# EAGLE design Oven Control (EAGLE 9.3.0)
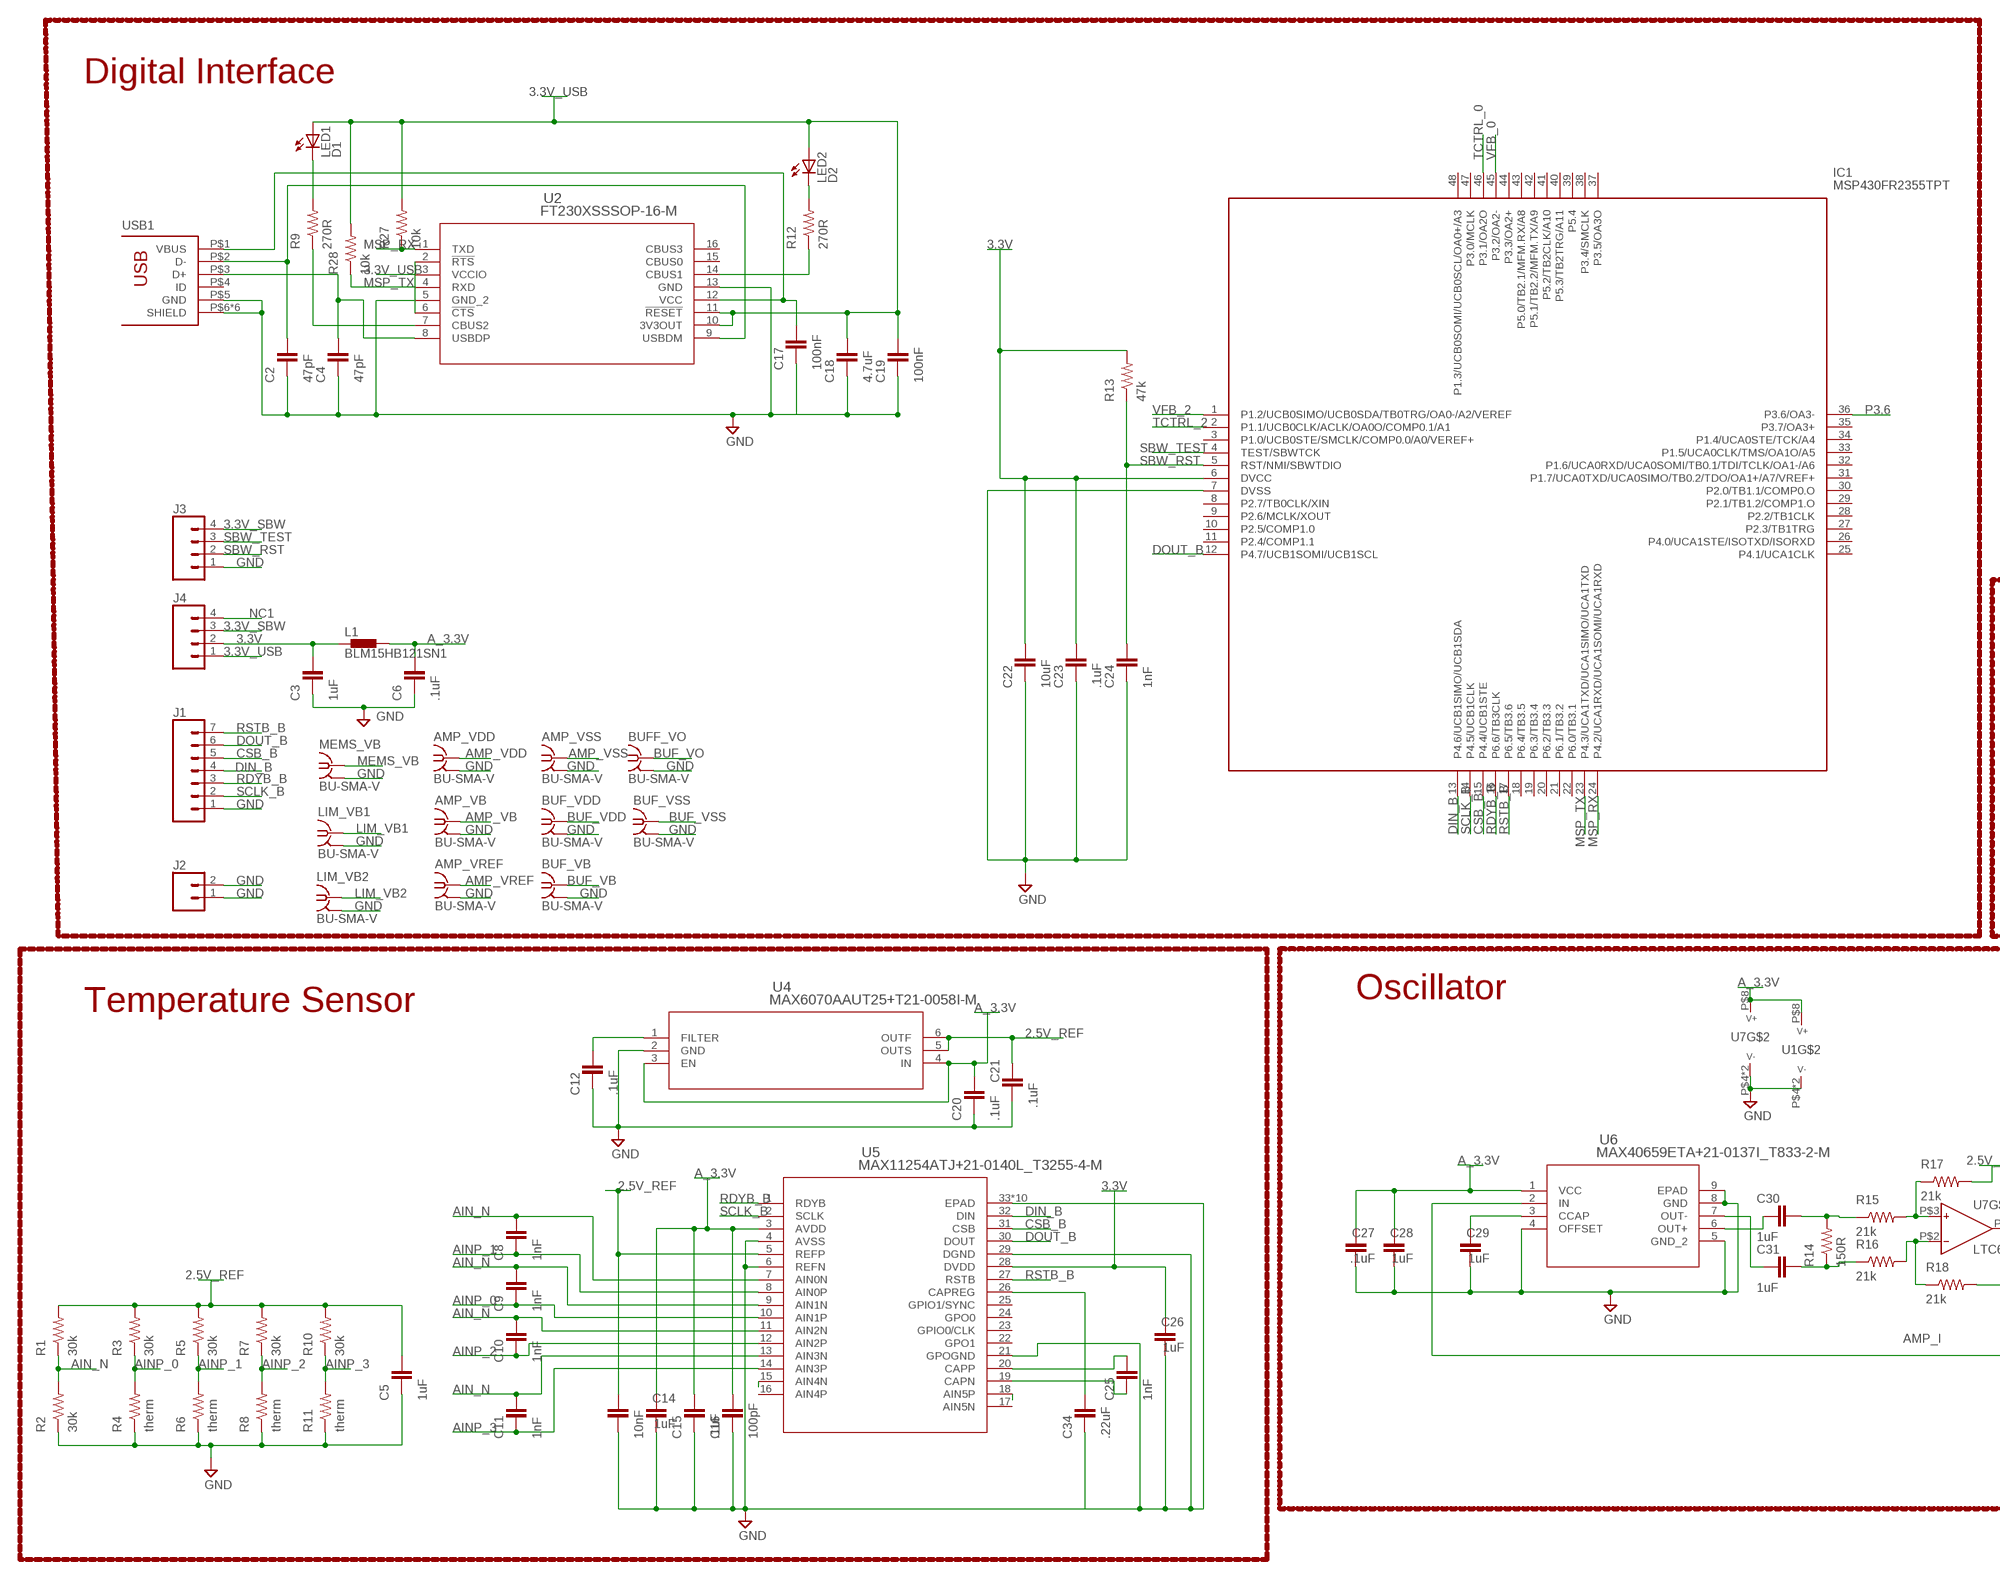
[diagram p0: schematic, sheet 1, part 1 of 2]
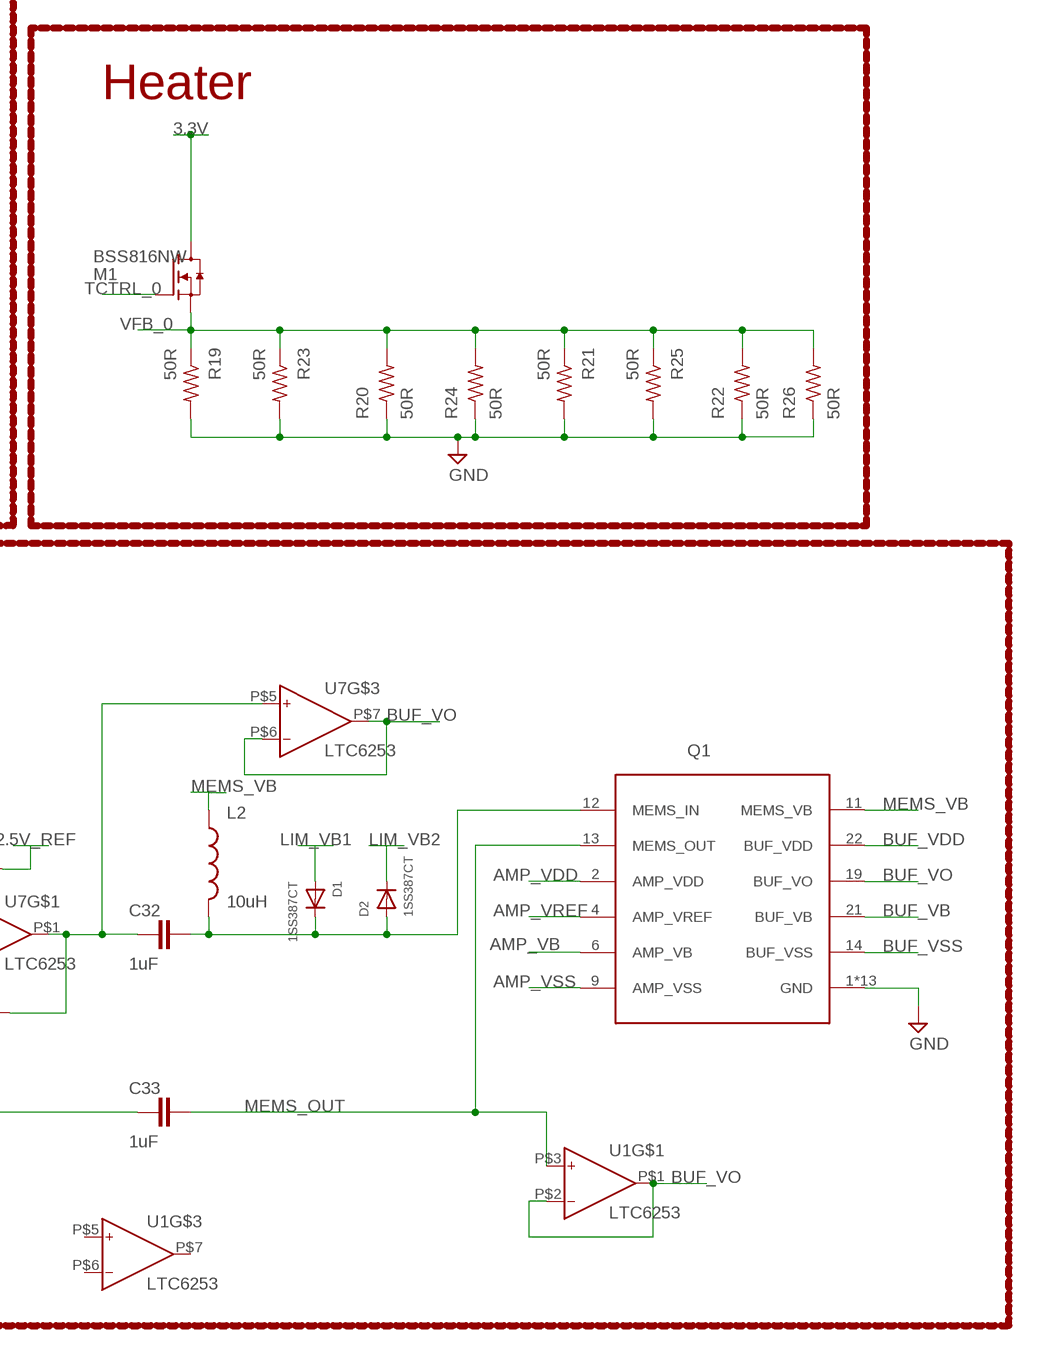
[diagram p1: schematic, sheet 1, part 2 of 2]

## Parts
AMP_VB  BU-SMA-V  [BU-SMA-V]
AMP_VDD  BU-SMA-V  [BU-SMA-V]
AMP_VREF  BU-SMA-V  [BU-SMA-V]
AMP_VSS  BU-SMA-V  [BU-SMA-V]
BUF_VB  BU-SMA-V  [BU-SMA-V]
BUF_VDD  BU-SMA-V  [BU-SMA-V]
BUF_VSS  BU-SMA-V  [BU-SMA-V]
BUFF_VO  BU-SMA-V  [BU-SMA-V]
C2  47pF  CAP0402-CAP  [0402-CAP]
C3  1uF  CAP0402-CAP  [0402-CAP]
C4  47pF  CAP0402-CAP  [0402-CAP]
C5  1uF  CAP0402-CAP  [0402-CAP]
C6  .1uF  CAP0402-CAP  [0402-CAP]
C8  1nF  CAP0402-CAP  [0402-CAP]
C9  1nF  CAP0402-CAP  [0402-CAP]
C10  1nF  CAP0402-CAP  [0402-CAP]
C11  1nF  CAP0402-CAP  [0402-CAP]
C12  .1uF  CAP0402-CAP  [0402-CAP]
C13  10nF  CAP0402-CAP  [0402-CAP]
C14  1uF  CAP0402-CAP  [0402-CAP]
C15  .1uF  CAP0402-CAP  [0402-CAP]
C16  100pF  CAP0402-CAP  [0402-CAP]
C17  100nF  CAP0402-CAP  [0402-CAP]
C18  4.7uF  CAP0402-CAP  [0402-CAP]
C19  100nF  CAP0402-CAP  [0402-CAP]
C20  .1uF  CAP0402-CAP  [0402-CAP]
C21  .1uF  CAP0402-CAP  [0402-CAP]
C22  10uF  CAP0603-CAP  [0603-CAP]
C23  .1uF  CAP0402-CAP  [0402-CAP]
C24  1nF  CAP0402-CAP  [0402-CAP]
C25  1nF  CAP0402-CAP  [0402-CAP]
C26  1uF  CAP0402-CAP  [0402-CAP]
C27  .1uF  CAP0402-CAP  [0402-CAP]
C28  1uF  CAP0402-CAP  [0402-CAP]
C29  1uF  CAP0402-CAP  [0402-CAP]
C30  1uF  CAP0402-CAP  [0402-CAP]
C31  1uF  CAP0402-CAP  [0402-CAP]
C32  1uF  CAP0402-CAP  [0402-CAP]
C33  1uF  CAP0402-CAP  [0402-CAP]
C34  .22uF  CAP0402-CAP  [0402-CAP]
D1  1SS387CT  [SOD-882]
D2  1SS387CT  [SOD-882]
IC1  MSP430FR2355TPT  [QFP50P900X900X145-48N]
J1  CONN_07  [1X07]
J2  CONN_02  [1X02]
J3  CONN_04  [1X04]
J4  CONN_04  [1X04]
L1  BLM15HB121SN1  [0402]
L2  10uH  INDUCTOR_0805  [R0805]
LED1  D1  LEDCHIPLED_0603  [CHIPLED_0603]
LED2  D2  LEDCHIPLED_0603  [CHIPLED_0603]
LIM_VB1  BU-SMA-V  [BU-SMA-V]
LIM_VB2  BU-SMA-V  [BU-SMA-V]
M1  BSS816NW  [SOT-323]
MEMS_VB  BU-SMA-V  [BU-SMA-V]
Q1  MEMS_RESONATOR  [DIL24]
R1  30k  R-US_R0603  [R0603]
R2  30k  R-US_R0603  [R0603]
R3  30k  R-US_R0603  [R0603]
R4  therm  R-US_R0603  [R0603]
R5  30k  R-US_R0603  [R0603]
R6  therm  R-US_R0603  [R0603]
R7  30k  R-US_R0603  [R0603]
R8  therm  R-US_R0603  [R0603]
R9  270R  R-US_R0603  [R0603]
R10  30k  R-US_R0603  [R0603]
R11  therm  R-US_R0603  [R0603]
R12  270R  R-US_R0603  [R0603]
R13  47k  R-US_R0603  [R0603]
R14  150R  R-US_R0402  [R0402]
R15  21k  R-US_R0402  [R0402]
R16  21k  R-US_R0402  [R0402]
R17  21k  R-US_R0402  [R0402]
R18  21k  R-US_R0402  [R0402]
R19  50R  R-US_R1206  [R1206]
R20  50R  R-US_R1206  [R1206]
R21  50R  R-US_R1206  [R1206]
R22  50R  R-US_R1206  [R1206]
R23  50R  R-US_R1206  [R1206]
R24  50R  R-US_R1206  [R1206]
R25  50R  R-US_R1206  [R1206]
R26  50R  R-US_R1206  [R1206]
R27  10k  R-US_R0402  [R0402]
R28  10k  R-US_R0402  [R0402]
U1  LTC6253  [DFN]
U2  FT230XSSSOP-16-M  [SSOP-16-M]
U4  MAX6070AAUT25+T21-0058I-M  [21-0058I-M]
U5  MAX11254ATJ+21-0140L_T3255-4-M  [21-0140L_T3255-4-M]
U6  MAX40659ETA+21-0137I_T833-2-M  [21-0137I_T833-2-M]
U7  LTC6253  [DFN]
USB1  USB-OTGMICRO-AB  [USB-MICRO-AB]

## Nets
2.5V_REF: C5.2 C13.2 C21.2 R1.2 R3.2 R5.2 R7.2 R10.2 R17.2 U4.5(OUTS) U4.6(OUTF) U5.5(REFP)
3.3V: C3.2 C22.2 C23.2 C26.2 IC1.6(DVCC) J4.2 L1.1 M1.D R13.2 U5.28(DVDD)
3.3V_SBW: J3.4 J4.3
3.3V_USB: C18.2 C19.2 J4.1 LED1.A LED2.A R27.2 R28.2 U2.3(VCCIO) U2.10(3V3OUT) U2.11(!RESET)
5V_USB: C17.2 U2.12(VCC) USB1.P$1(VBUS)
A_3.3V: C6.2 C14.2 C15.2 C16.2 C20.2 C27.2 C28.2 L1.2 U1.P$8(V+) U4.3(EN) U4.4(IN) U5.3(AVDD) U6.1(VCC) U7.P$8(V+)
AIN_N: C8.2 C9.2 C10.2 C11.2 R1.1 R2.2 U5.7(AIN0N) U5.9(AIN1N) U5.11(AIN2N) U5.13(AIN3N)
AINP_0: C9.1 R3.1 R4.2 U5.10(AIN1P)
AINP_1: C8.1 R5.1 R6.2 U5.8(AIN0P)
AINP_2: C10.1 R7.1 R8.2 U5.12(AIN2P)
AINP_3: C11.1 R10.1 R11.2 U5.14(AIN3P)
AMP_I: C33.1 U6.2(IN)
AMP_VB: AMP_VB.1 Q1.6(AMP_VB)
AMP_VDD: AMP_VDD.1 Q1.2(AMP_VDD)
AMP_VREF: AMP_VREF.1 Q1.4(AMP_VREF)
AMP_VSS: AMP_VSS.1 Q1.9(AMP_VSS)
BUF_VB: BUF_VB.1 Q1.21(BUF_VB)
BUF_VDD: BUF_VDD.1 Q1.22(BUF_VDD)
BUF_VO: BUFF_VO.1 Q1.19(BUF_VO) U1.P$1(OUT) U1.P$2(IN-) U7.P$6(IN-) U7.P$7(OUT)
BUF_VSS: BUF_VSS.1 Q1.14(BUF_VSS)
CSB_B: IC1.15(P4.4/UCB1STE) J1.5 U5.31(CSB)
D+: C4.2 U2.8(USBDP) USB1.P$3(D+)
D-: C2.2 U2.9(USBDM) USB1.P$2(D-)
DIN_B: IC1.13(P4.6/UCB1SIMO/UCB1SDA) J1.4 U5.32(DIN)
DOUT_B: IC1.12(P4.7/UCB1SOMI/UCB1SCL) J1.6 U5.30(DOUT)
GND: AMP_VB.2 AMP_VB.3 AMP_VB.4 AMP_VB.5 AMP_VDD.2 AMP_VDD.3 AMP_VDD.4 AMP_VDD.5 AMP_VREF.2 AMP_VREF.3 AMP_VREF.4 AMP_VREF.5 AMP_VSS.2 AMP_VSS.3 AMP_VSS.4 AMP_VSS.5 BUF_VB.2 BUF_VB.3 BUF_VB.4 BUF_VB.5 BUF_VDD.2 BUF_VDD.3 BUF_VDD.4 BUF_VDD.5 BUF_VSS.2 BUF_VSS.3 BUF_VSS.4 BUF_VSS.5 BUFF_VO.2 BUFF_VO.3 BUFF_VO.4 BUFF_VO.5 C2.1 C3.1 C4.1 C5.1 C6.1 C12.1 C13.1 C14.1 C15.1 C16.1 C17.1 C18.1 C19.1 C20.1 C21.1 C22.1 C23.1 C24.1 C26.1 C27.1 C28.1 C29.1 C34.1 IC1.7(DVSS) J1.1 J2.1 J2.2 J3.1 LIM_VB1.2 LIM_VB1.3 LIM_VB1.4 LIM_VB1.5 LIM_VB2.2 LIM_VB2.3 LIM_VB2.4 LIM_VB2.5 MEMS_VB.2 MEMS_VB.3 MEMS_VB.4 MEMS_VB.5 Q1.1(GND) Q1.3(GND) Q1.5(GND) Q1.7(GND) Q1.8(GND) Q1.10(GND) Q1.15(GND) Q1.16(GND) Q1.17(GND) Q1.18(GND) Q1.20(GND) Q1.23(GND) Q1.24(GND) R2.1 R4.1 R6.1 R8.1 R11.1 R19.2 R20.1 R21.2 R22.1 R23.2 R24.1 R25.2 R26.1 U1.P$4(V-) U1.P$9(V-) U2.5(GND_2) U2.13(GND) U4.2(GND) U5.4(AVSS) U5.6(REFN) U5.21(GPOGND) U5.29(DGND) U5.33(EPAD) U5.P$1(EPAD) U5.P$2(EPAD) U5.P$3(EPAD) U5.P$4(EPAD) U5.P$5(EPAD) U5.P$6(EPAD) U5.P$7(EPAD) U5.P$8(EPAD) U5.P$9(EPAD) U6.4(OFFSET) U6.5(GND_2) U6.8(GND) U6.9(EPAD) U7.P$4(V-) U7.P$9(V-) USB1.P$5(GND) USB1.P$6(SHIELD) USB1.P$7(SHIELD) USB1.P$8(SHIELD) USB1.P$9(SHIELD) USB1.P$10(SHIELD) USB1.P$11(SHIELD)
LIM_VB1: D1.A LIM_VB1.1
LIM_VB2: D2.C LIM_VB2.1
MEMS_IN: C32.2 D1.C D2.A L2.2 Q1.12(MEMS_IN)
MEMS_OUT: C33.2 Q1.13(MEMS_OUT) U1.P$3(IN+)
MEMS_VB: L2.1 MEMS_VB.1 Q1.11(MEMS_VB)
MSP_RX: IC1.24(P4.2/UCA1RXD/UCA1SOMI/UCA1RXD) R27.1 U2.1(TXD)
MSP_TX: IC1.23(P4.3/UCA1TXD/UCA1SIMO/UCA1TXD) R28.1 U2.4(RXD)
N$1: C25.2 U5.20(CAPP)
N$2: C25.1 U5.19(CAPN)
N$3: C31.2 R14.1 R16.1
N$4: C29.2 U6.3(CCAP)
N$5: U5.17(AIN5N)
N$6: C12.2 U4.1(FILTER)
N$7: C30.2 R14.2 R15.1
N$8: U5.16(AIN4P)
N$10: C34.2 U5.26(CAPREG)
N$12: R15.2 R17.1 U7.P$3(IN+)
N$13: R16.2 R18.1 U7.P$2(IN-)
N$15: U2.2(!RTS) U2.6(!CTS)
N$18: C32.1 R18.2 U7.P$1(OUT) U7.P$5(IN+)
N$19: C30.1 U6.6(OUT+)
N$20: LED2.C R12.2
N$21: LED1.C R9.2
N$26: C31.1 U6.7(OUT-)
N$34: U5.18(AIN5P)
N$35: U5.15(AIN4N)
NC1: J4.4
P3.6: IC1.36(P3.6/OA3-)
RDYB_B: IC1.16(P6.6/TB3CLK) J1.3 U5.1(RDYB)
RSTB_B: IC1.17(P6.5/TB3.6) J1.7 U5.27(RSTB)
RX#1: R12.1 U2.14(CBUS1)
SBW_RST: C24.2 IC1.5(RST/NMI/SBWTDIO) J3.2 R13.1
SBW_TEST: IC1.4(TEST/SBWTCK) J3.3
SCLK_B: IC1.14(P4.5/UCB1CLK) J1.2 U5.2(SCLK)
TCTRL_0: IC1.46(P3.1/OA2O) M1.G
TCTRL_2: IC1.2(P1.1/UCB0CLK/ACLK/OA0O/COMP0.1/A1)
TX#1: R9.1 U2.7(CBUS2)
VFB_0: IC1.45(P3.2/OA2-) M1.S R19.1 R20.2 R21.1 R22.2 R23.1 R24.2 R25.1 R26.2
VFB_2: IC1.1(P1.2/UCB0SIMO/UCB0SDA/TB0TRG/OA0-/A2/VEREF)
Unconnected: IC1.3(P1.0/UCB0STE/SMCLK/COMP0.0/A0/VEREF+) IC1.8(P2.7/TB0CLK/XIN) IC1.9(P2.6/MCLK/XOUT) IC1.10(P2.5/COMP1.0) IC1.11(P2.4/COMP1.1) IC1.18(P6.4/TB3.5) IC1.19(P6.3/TB3.4) IC1.20(P6.2/TB3.3) IC1.21(P6.1/TB3.2) IC1.22(P6.0/TB3.1) IC1.25(P4.1/UCA1CLK) IC1.26(P4.0/UCA1STE/ISOTXD/ISORXD) IC1.27(P2.3/TB1TRG) IC1.28(P2.2/TB1CLK) IC1.29(P2.1/TB1.2/COMP1.O) IC1.30(P2.0/TB1.1/COMP0.O) IC1.31(P1.7/UCA0TXD/UCA0SIMO/TB0.2/TDO/OA1+/A7/VREF+) IC1.32(P1.6/UCA0RXD/UCA0SOMI/TB0.1/TDI/TCLK/OA1-/A6) IC1.33(P1.5/UCA0CLK/TMS/OA1O/A5) IC1.34(P1.4/UCA0STE/TCK/A4) IC1.35(P3.7/OA3+) IC1.37(P3.5/OA3O) IC1.38(P3.4/SMCLK) IC1.39(P5.4) IC1.40(P5.3/TB2TRG/A11) IC1.41(P5.2/TB2CLK/A10) IC1.42(P5.1/TB2.2/MFM.TX/A9) IC1.43(P5.0/TB2.1/MFM.RX/A8) IC1.44(P3.3/OA2+) IC1.47(P3.0/MCLK) IC1.48(P1.3/UCB0SOMI/UCB0SCL/OA0+/A3) U1.P$5(IN+) U1.P$6(IN-) U1.P$7(OUT) U2.15(CBUS0) U2.16(CBUS3) U5.22(GPO1) U5.23(GPIO0/CLK) U5.24(GPO0) U5.25(GPIO1/SYNC) USB1.P$4(ID)

## Notes on the sheet
- Digital Interface
- Heater
- Oscillator
- Temperature Sensor

## Library data of the parts
AMP_VB AMP_VDD AMP_VREF AMP_VSS BUF_VB BUF_VDD BUF_VSS BUFF_VO LIM_VB1 LIM_VB2 MEMS_VB = con-coax:BU-SMA-V: FEMALE SMA CONNECTOR Radiall distributor RS 112-3794; OC_FARNELL: unknown; OC_NEWARK: unknown
C2-C6 C8-C34 = pie:CAP: Capacitor Standard 0603 ceramic capacitor, and 0.1" leaded capacitor.; PIE-INT-REF-NUM: CAPACITOR-GENERIC
D1 D2 = Oven Control Lib:1SS387CT; PART_NO: 1SS387CT
IC1 = Oven Control Lib:MSP430FR2355TPT: 16-bit Microcontrollers - MCU 24MHz 105C ULP Microcontroller With 32 KB FRAM, 4 KB SRAM, 44 IO, 12-bit ADC, 12-bit DACs, OpAmp/PGA 48-LQFP -40 to 105 Source: Datasheet <https://www.arrow.com/en/products/msp430fr2355tpt/texas-instruments>; DESCRIPTION: 16-bit Microcontrollers - MCU 24MHz 105C ULP Microcontroller With 32 KB FRAM, 4 KB SRAM, 44 IO, 12-bit ADC, 12-bit DACs, OpAmp/PGA 48-LQFP -40 to 105; HEIGHT: 1.45mm; MANUFACTURER_NAME: Texas Instruments; MANUFACTURER_PART_NUMBER: MSP430FR2355TPT
J1 = SparkFun-Connectors:CONN_07: Multi connection point. Often used as Generic Header-pin footprint for 0.1 inch spaced/style header connections On any of the 0.1 inch spaced packages, you can populate with these: Break Away Headers - Straight <https://www.sparkfun.com/products/116> (PRT-00116) Break Away Male Headers - Right Angle <https://www.sparkfun.com/products/553> (PRT-00553) Female Headers <https://www.sparkfun.com/products/115> (PRT-00115) Break Away Headers - Machine Pin <https://www.sparkfun.com/products/117> (PRT-00117) Break Away Female Headers - Swiss Machine Pin <https://www.sparkfun.com/products/743> (PRT-00743) For SCREWTERMINALS and SPRING TERMINALS visit here: Screw Terimnals on SparkFun.com <https://www.sparkfun.com/search/results?term=Screw+Terminals> (5mm/3.5mm/2.54mm spacing) This device is also useful as a general connection point to wire up your design to another part of your project. Our various solder wires solder well into these plated through hole pads. Hook-Up Wire - Assortment (Stranded, 22 AWG) <https://www.sparkfun.com/products/11375> (PRT-11375) Hook-Up Wire - Assortment (Solid Core, 22 AWG) <https://www.sparkfun.com/products/11367> (PRT-11367) View the entire wire category on our website here <https://www.sparkfun.com/categories/141> Special notes: Molex polarized connector foot print use with SKU : PRT-08231 with associated crimp pins and housings. 1MM SMD Version SKU: PRT-10208 NOTES ON THE VARIANTS LOCK and LOCK_LONGPADS... This footprint was designed to help hold the alignment of a through-hole component (i.e. 6-pin header) while soldering it into place. You may notice that each hole has been shifted either up or down by 0.005 of an inch from it's more standard position (which is a perfectly straight line). This slight alteration caused the pins (the squares in the middle) to touch the edges of the holes. Because they are alternating, it causes a "brace" to hold the component in place. 0.005 has proven to be the perfect amount of "off-center" position when using our standard breakaway headers. Although looks a little odd when you look at the bare footprint, once you have a header in there, the alteration is very hard to notice. Also,if you push a header all the way into place, it is covered up entirely on the bottom side.
J2 = SparkFun-Connectors:CONN_02: Multi connection point. Often used as Generic Header-pin footprint for 0.1 inch spaced/style header connections On any of the 0.1 inch spaced packages, you can populate with these: Break Away Headers - Straight <https://www.sparkfun.com/products/116> (PRT-00116) Break Away Male Headers - Right Angle <https://www.sparkfun.com/products/553> (PRT-00553) Female Headers <https://www.sparkfun.com/products/115> (PRT-00115) Break Away Headers - Machine Pin <https://www.sparkfun.com/products/117> (PRT-00117) Break Away Female Headers - Swiss Machine Pin <https://www.sparkfun.com/products/743> (PRT-00743) For SCREWTERMINALS and SPRING TERMINALS visit here: Screw Terimnals on SparkFun.com <https://www.sparkfun.com/search/results?term=Screw+Terminals> (5mm/3.5mm/2.54mm spacing) This device is also useful as a general connection point to wire up your design to another part of your project. Our various solder wires solder well into these plated through hole pads. Hook-Up Wire - Assortment (Stranded, 22 AWG) <https://www.sparkfun.com/products/11375> (PRT-11375) Hook-Up Wire - Assortment (Solid Core, 22 AWG) <https://www.sparkfun.com/products/11367> (PRT-11367) View the entire wire category on our website here <https://www.sparkfun.com/categories/141> Special notes: Molex polarized connector foot print use with: PRT-08233 with associated crimp pins and housings. 2.54_SCREWTERM for use with PRT-10571. 3.5mm Screw Terminal footprints for PRT-08084 5mm Screw Terminal footprints for use with PRT-08432
J3 J4 = SparkFun-Connectors:CONN_04: Multi connection point. Often used as Generic Header-pin footprint for 0.1 inch spaced/style header connections On any of the 0.1 inch spaced packages, you can populate with these: Break Away Headers - Straight <https://www.sparkfun.com/products/116> (PRT-00116) Break Away Male Headers - Right Angle <https://www.sparkfun.com/products/553> (PRT-00553) Female Headers <https://www.sparkfun.com/products/115> (PRT-00115) Break Away Headers - Machine Pin <https://www.sparkfun.com/products/117> (PRT-00117) Break Away Female Headers - Swiss Machine Pin <https://www.sparkfun.com/products/743> (PRT-00743) For SCREWTERMINALS and SPRING TERMINALS visit here: Screw Terimnals on SparkFun.com <https://www.sparkfun.com/search/results?term=Screw+Terminals> (5mm/3.5mm/2.54mm spacing) This device is also useful as a general connection point to wire up your design to another part of your project. Our various solder wires solder well into these plated through hole pads. Hook-Up Wire - Assortment (Stranded, 22 AWG) <https://www.sparkfun.com/products/11375> (PRT-11375) Hook-Up Wire - Assortment (Solid Core, 22 AWG) <https://www.sparkfun.com/products/11367> (PRT-11367) View the entire wire category on our website here <https://www.sparkfun.com/categories/141> Special notes: Molex polarized connector foot print use with SKU : PRT-08231 with associated crimp pins and housings. 1MM SMD Version SKU: PRT-10208; PROD_ID: CONN-09696
L1 = inductors:BLM15H: EMIFIL (R) Chip Ferrite Bead for GHz Noise Source: http://www.murata.com/ Ferrite Bead BLM15H.pdf
L2 = Oven Control Lib:INDUCTOR_0805
LED1 LED2 = adafruit:LED: LED OSRAM: - CHIPLED LG R971, LG N971, LY N971, LG Q971, LY Q971, LO R971, LY R971 LH N974, LH R974 LS Q976, LO Q976, LY Q976 LO Q996 - Hyper CHIPLED LW Q18S LB Q993, LB Q99A, LB R99A - SideLED LS A670, LO A670, LY A670, LG A670, LP A670 LB A673, LV A673, LT A673, LW A673 LH A674 LY A675 LS A676, LA A676, LO A676, LY A676, LW A676 LS A679, LY A679, LG A679 - Hyper Micro SIDELED® LS Y876, LA Y876, LO Y876, LY Y876 LT Y87S - SmartLED LW L88C, LW L88S LB L89C, LB L89S, LG L890 LS L89K, LO L89K, LY L89K LS L896, LA L896, LO L896, LY L896 - TOPLED LS T670, LO T670, LY T670, LG T670, LP T670 LSG T670, LSP T670, LSY T670, LOP T670, LYG T670 LG T671, LOG T671, LSG T671 LB T673, LV T673, LT T673, LW T673 LH T674 LS T676, LA T676, LO T676, LY T676, LB T676, LH T676, LSB T676, LW T676 LB T67C, LV T67C, LT T67C, LS T67K, LO T67K, LY T67K, LW E67C LS E67B, LA E67B, LO E67B, LY E67B, LB E67C, LV E67C, LT E67C LW T67C LS T679, LY T679, LG T679 LS T770, LO T770, LY T770, LG T770, LP T770 LB T773, LV T773, LT T773, LW T773 LH T774 LS E675, LA E675, LY E675, LS T675 LS T776, LA T776, LO T776, LY T776, LB T776 LHGB T686 LT T68C, LB T68C - Hyper Mini TOPLED® LB M676 - Mini TOPLED Santana® LG M470 LS M47K, LO M47K, LY M47K Source: http://www.osram.convergy.de/
M1 = Oven Control Lib:BSS816NW
Q1 = Oven Control Lib:MEMS_RESONATOR
R1-R13 = pie:R-US_: RESISTOR, American symbol; DESCRIPTION: RESISTOR, American symbol; DISTRIBUTOR: DigiKey; MANUFACTURER: Rohm Semiconductor; NOTES: Cut Tape; PACKAGE: R0603; VALUE: >VALUE
R14-R28 = pie:R-US_: RESISTOR, American symbol; PIE-INT-REF-NUM: RESISTOR-GENERIC
U1 = Oven Control Lib:LTC6253
U2 = Oven Control Lib:FT230XS; MANUFACTURER_PART_NUMBER: FT230XS; VENDOR: FTDI Future Technology Devices International Ltd
U4 = Oven Control Lib:MAX6070AAUT25+T; MANUFACTURER_PART_NUMBER: MAX6070AAUT25+T; VENDOR: Maxim Integrated Products
U5 = Oven Control Lib:MAX11254ATJ+; MANUFACTURER_PART_NUMBER: MAX11254ATJ+; VENDOR: Maxim Integrated Products
U6 = Oven Control Lib:MAX40659ETA+; MANUFACTURER_PART_NUMBER: MAX40659ETA+; VENDOR: Maxim Integrated Products
U7 = Oven Control Lib:LTC6253; PART_NO: LTC6253
USB1 = pie:USB-OTG: USB Connector OTG connector with ID pin; PIE-DIGIKEY-PN-PRI: H11635CT-ND; PIE-INT-REF-NUM: USB

## Board
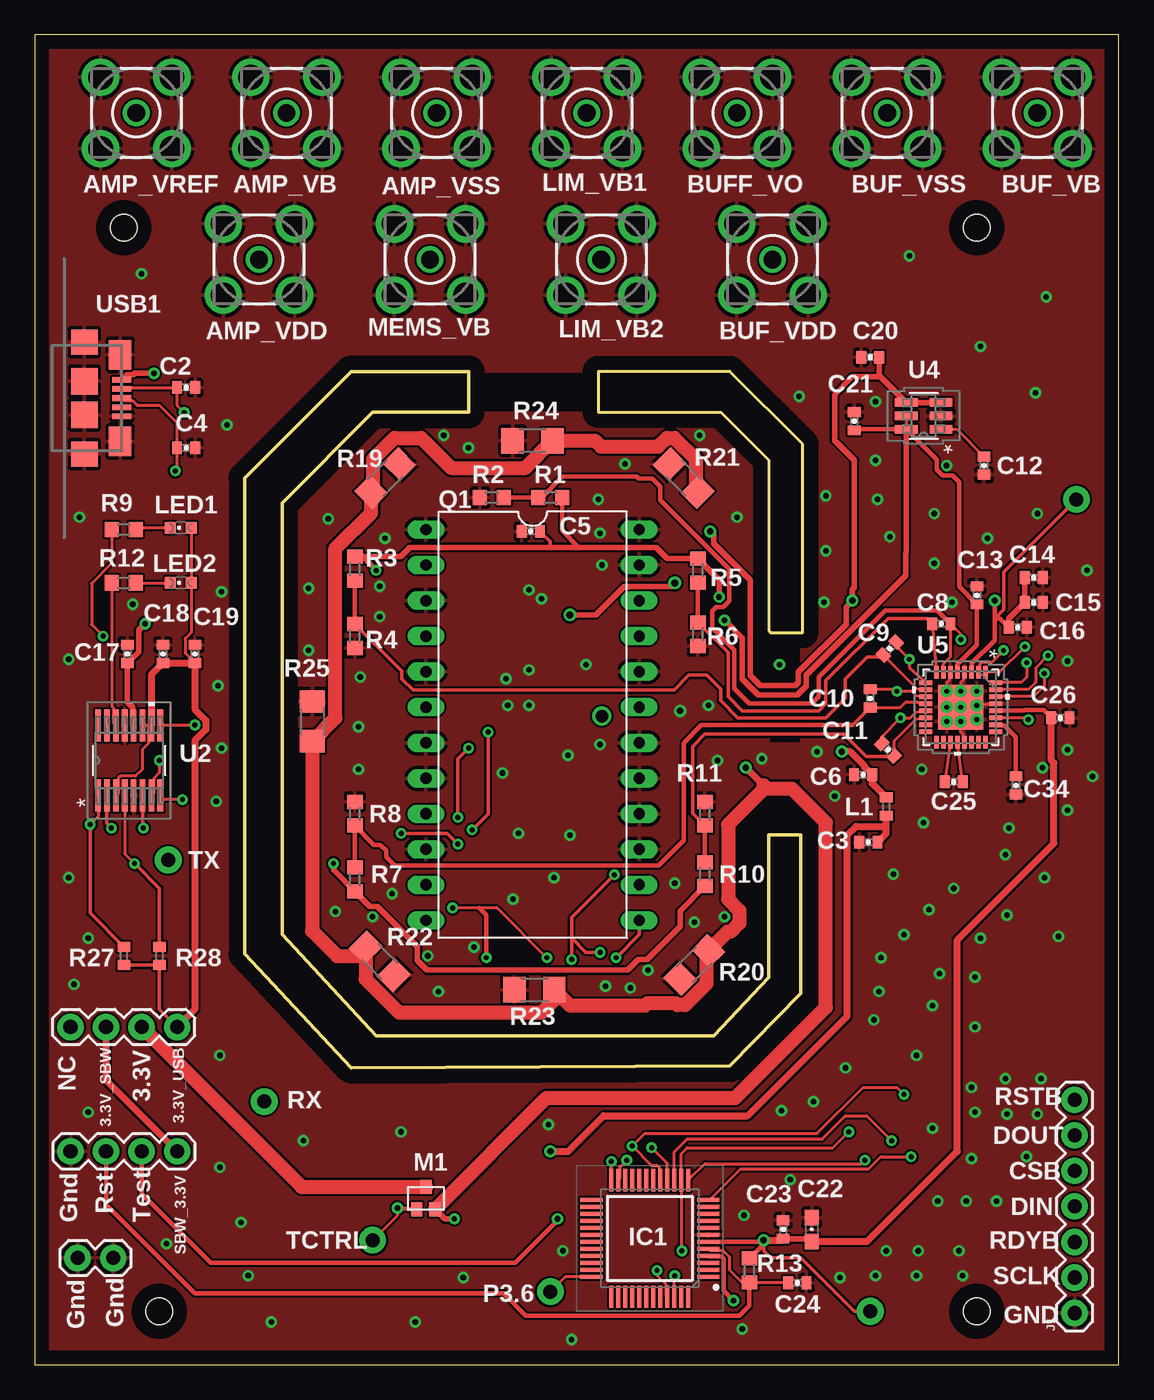
[diagram p2: board, top side]
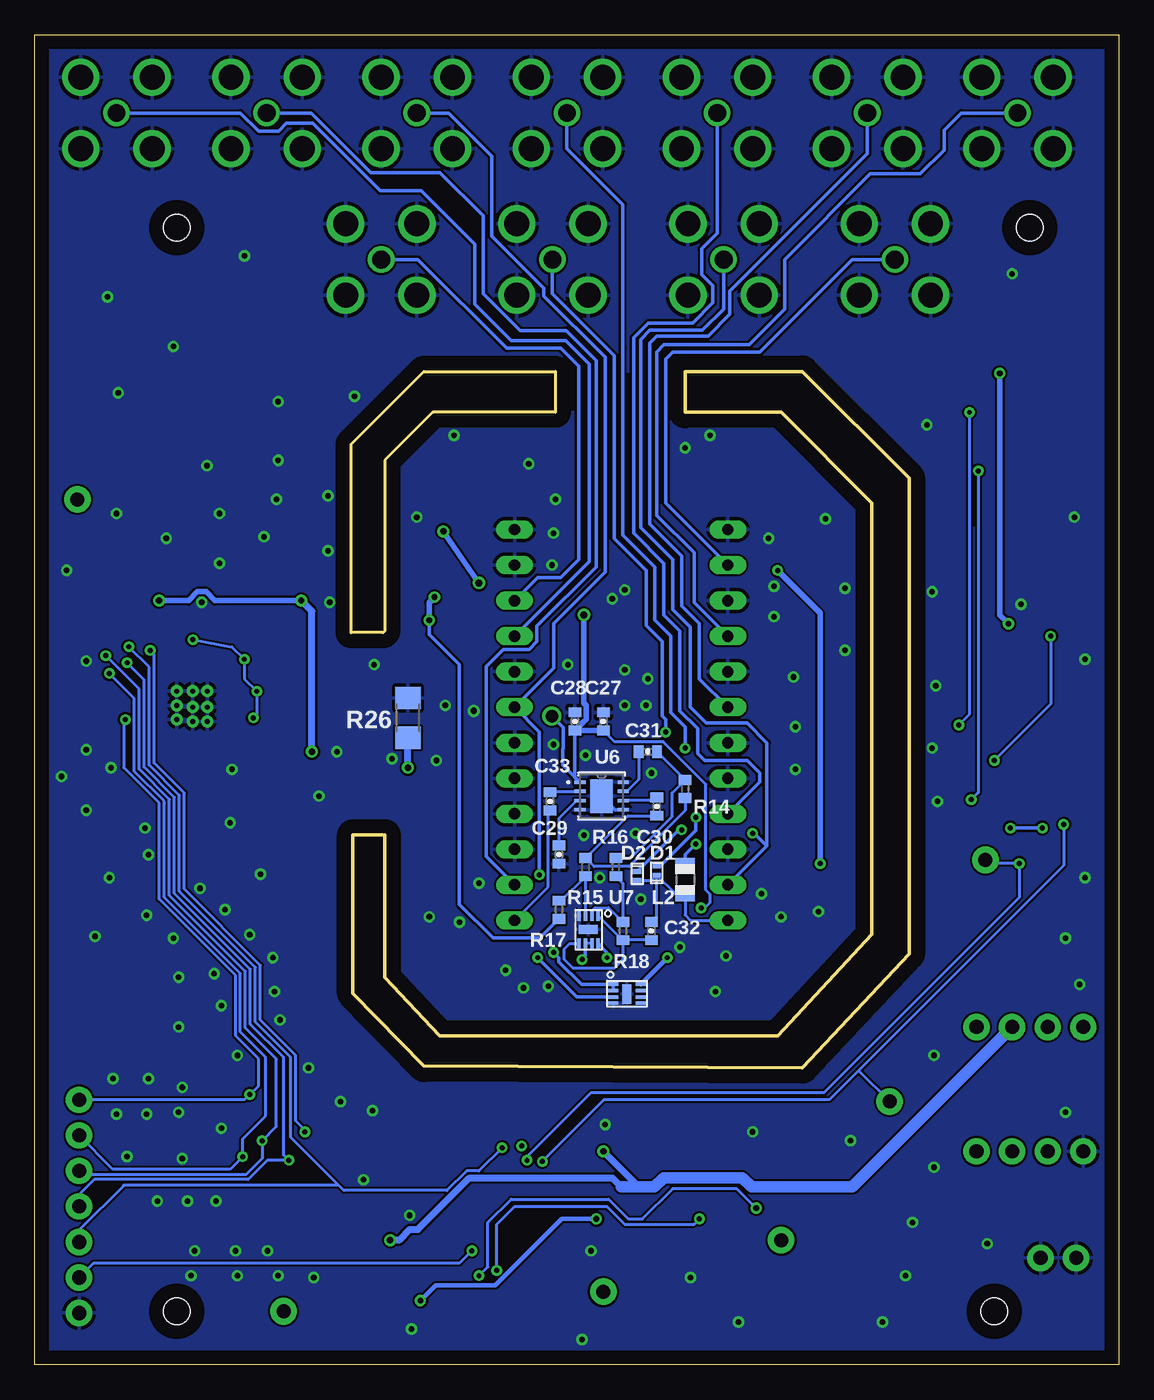
[diagram p3: board, bottom side, seen from below]

Size 77.45 x 95.05 mm. Coordinates in mm from the lower left corner, seen from the top.
Outline: 0,0 77.45,0 77.45,95.05 0,95.05 0,0
Outline: 30.99,70.99 22.61,70.99 14.99,63.37 14.99,29.34 22.61,21.21 49.66,21.34 54.74,26.54 54.74,37.85 52.45,37.85 52.45,27.69 48.51,23.5 24.38,23.5 17.65,30.73 17.65,61.59 24.13,68.07 30.99,68.07 30.99,70.99
Outline: 40.26,70.99 40.26,68.07 49.02,68.07 52.45,64.64 52.45,52.45 52.58,52.32 54.86,52.32 54.86,65.79 49.66,70.99 40.26,70.99
Copper layers (1*16): Top 0.035mm / dielectric 1.5mm / Bottom 0.035mm
Design rules "default": minimum track width 6mil, minimum drill 0.35mm, track to track 6mil, track to pad 6mil, pad to pad 6mil, via to via 6mil, smd to smd 6mil, copper to edge 40mil, drill to drill 6mil, minimum pad ring 10mil, minimum via ring 8mil, stop-mask expansion 4mil, vias tented up to drill 0mil, thermal gap 10mil
Holes 1.91 mm at 8.89,3.81 67.31,3.81 67.31,81.28 6.35,81.28

### Footprints (pad centres in the part's own frame; a part is rotated, then mirrored left to right if it is on the bottom)
BU-SMA-V = drill 1.27: 1 0,0 | drill 1.778: 2 -2.55,2.55; 3 2.55,2.55; 4 2.55,-2.55; 5 -2.55,-2.55
0402-CAP = smd 0.7 x 0.9: 1 -0.65,0; 2 0.65,0
0603-CAP = smd 1.1 x 1: 1 -0.85,0; 2 0.85,0
SOD-882 = smd 0.35 x 0.6: A 0.325,0; C -0.325,0
QFP50P900X900X145-48N = smd 1.6 x 0.3: 1 -4.175,2.75; 2 -4.175,2.25; 3 -4.175,1.75; 4 -4.175,1.25; 5 -4.175,0.75; 6 -4.175,0.25; 7 -4.175,-0.25; 8 -4.175,-0.75; 9 -4.175,-1.25; 10 -4.175,-1.75; 11 -4.175,-2.25; 12 -4.175,-2.75; 25 4.175,-2.75; 26 4.175,-2.25; 27 4.175,-1.75; 28 4.175,-1.25; 29 4.175,-0.75; 30 4.175,-0.25; 31 4.175,0.25; 32 4.175,0.75; 33 4.175,1.25; 34 4.175,1.75; 35 4.175,2.25; 36 4.175,2.75 | smd 0.3 x 1.6: 13 -2.75,-4.175; 14 -2.25,-4.175; 15 -1.75,-4.175; 16 -1.25,-4.175; 17 -0.75,-4.175; 18 -0.25,-4.175; 19 0.25,-4.175; 20 0.75,-4.175; 21 1.25,-4.175; 22 1.75,-4.175; 23 2.25,-4.175; 24 2.75,-4.175; 37 2.75,4.175; 38 2.25,4.175; 39 1.75,4.175; 40 1.25,4.175; 41 0.75,4.175; 42 0.25,4.175; 43 -0.25,4.175; 44 -0.75,4.175; 45 -1.25,4.175; 46 -1.75,4.175; 47 -2.25,4.175; 48 -2.75,4.175
1X07 = drill 1.016 pad 1.88: 1 0,0; 2 2.54,0; 3 5.08,0; 4 7.62,0; 5 10.16,0; 6 12.7,0; 7 15.24,0
1X02 = drill 1.016 pad 1.88: 1 0,0; 2 2.54,0
1X04 = drill 1.016 pad 1.88: 1 0,0; 2 2.54,0; 3 5.08,0; 4 7.62,0
0402 = smd 0.7 x 0.9: 1 -0.65,0; 2 0.65,0
R0805 = smd 1.1 x 1.4: 1 -1,0; 2 1,0
CHIPLED_0603 = smd 0.8 x 0.8: A 0,-0.75; C 0,0.75
SOT-323 = smd 0.8 x 1: D 0,0; G -0.65,-1.6; S 0.65,-1.6
DIL24 = drill 0.813 long: 1 -13.97,-7.62; 2 -11.43,-7.62; 3 -8.89,-7.62; 4 -6.35,-7.62; 5 -3.81,-7.62; 6 -1.27,-7.62; 7 1.27,-7.62; 8 3.81,-7.62; 9 6.35,-7.62; 10 8.89,-7.62; 11 11.43,-7.62; 12 13.97,-7.62; 13 13.97,7.62; 14 11.43,7.62; 15 8.89,7.62; 16 6.35,7.62; 17 3.81,7.62; 18 1.27,7.62; 19 -1.27,7.62; 20 -3.81,7.62; 21 -6.35,7.62; 22 -8.89,7.62; 23 -11.43,7.62; 24 -13.97,7.62
R0603 = smd 1 x 1.1: 1 -0.85,0; 2 0.85,0
R0402 = smd 0.7 x 0.9: 1 -0.65,0; 2 0.65,0
R1206 = smd 1.6 x 1.803: 1 -1.422,0; 2 1.422,0
DFN = smd 0.25 x 0.7: P$1 0,0.05; P$2 -0.45,0.05; P$3 -0.9,0.05; P$4 -1.35,0.05; P$5 -1.35,-1.9; P$6 -0.9,-1.9; P$7 -0.45,-1.9; P$8 0,-1.9 | smd 1.37 x 0.64: P$9 -0.7,-0.9
SSOP-16-M = smd 2.286 x 0.406: 1 -2.515,2.223; 2 -2.515,1.587; 3 -2.515,0.953; 4 -2.515,0.318; 5 -2.515,-0.318; 6 -2.515,-0.953; 7 -2.515,-1.587; 8 -2.515,-2.223; 9 2.515,-2.223; 10 2.515,-1.587; 11 2.515,-0.953; 12 2.515,-0.318; 13 2.515,0.318; 14 2.515,0.953; 15 2.515,1.587; 16 2.515,2.223
21-0058I-M = smd 1.626 x 0.61: 1 -1.245,0.95; 2 -1.245,0; 3 -1.245,-0.95; 4 1.245,-0.95; 5 1.245,0; 6 1.245,0.95
21-0140L_T3255-4-M = smd 0.914 x 0.305: 1 -2.502,1.75; 2 -2.502,1.25; 3 -2.502,0.75; 4 -2.502,0.25; 5 -2.502,-0.25; 6 -2.502,-0.75; 7 -2.502,-1.25; 8 -2.502,-1.75; 17 2.502,-1.75; 18 2.502,-1.25; 19 2.502,-0.75; 20 2.502,-0.25; 21 2.502,0.25; 22 2.502,0.75; 23 2.502,1.25; 24 2.502,1.75 | smd 0.305 x 0.914: 9 -1.75,-2.502; 10 -1.25,-2.502; 11 -0.75,-2.502; 12 -0.25,-2.502; 13 0.25,-2.502; 14 0.75,-2.502; 15 1.25,-2.502; 16 1.75,-2.502; 25 1.75,2.502; 26 1.25,2.502; 27 0.75,2.502; 28 0.25,2.502; 29 -0.25,2.502; 30 -0.75,2.502; 31 -1.25,2.502; 32 -1.75,2.502 | smd 3.2 x 3.2: 33 0,0 | drill 0.35: P$1 -1.143,1.143; P$2 -0.127,1.143; P$3 0.889,1.143; P$4 0,0; P$5 1.016,0; P$6 -1.143,0; P$7 -1.143,-1.016; P$8 0,-1.016; P$9 1.016,-1.016
21-0137I_T833-2-M = smd 0.806 x 0.254: 1 -1.553,0.991; 2 -1.553,0.33; 3 -1.553,-0.33; 4 -1.553,-0.991; 5 1.553,-0.991; 6 1.553,-0.33; 7 1.553,0.33; 8 1.553,0.991 | smd 1.6 x 2.388: 9 0,0
USB-MICRO-AB = smd 0.4 x 1.35: P$1 -1.3,1; P$2 -0.65,1; P$3 0,1; P$4 0.65,1; P$5 1.3,1 | smd 2.1 x 1.6: P$6 -3.1,0.875; P$7 3.1,0.875 | smd 1.8 x 1.9: P$8 -4,-1.675; P$9 4,-1.675 | smd 1.9 x 1.9: P$10 -1.2,-1.675; P$11 1.2,-1.675

### Placement (x,y rotation side)
AMP_VB  17.97,89.47 0 top
AMP_VDD  16,78.99 0 top
AMP_VREF  7.24,89.47 0 top
AMP_VSS  28.7,89.47 0 top
BUF_VB  71.63,89.47 0 top
BUF_VDD  52.7,78.99 0 top
BUF_VSS  60.9,89.47 0 top
BUFF_VO  50.16,89.47 0 top
C2  10.79,69.85 180 top
C3  59.56,37.34 0 top
C4  10.79,65.53 180 top
C5  35.43,59.56 0 top
C6  59.18,42.16 0 top
C8  64.77,52.96 0 top
C9  61.09,51.18 45 top
C10  59.69,47.62 90 top
C11  60.96,43.94 135 top
C12  67.82,64.26 90 top
C13  67.31,54.99 270 top
C14  71.37,56.26 180 top
C15  71.37,54.48 180 top
C16  70.23,52.7 180 top
C17  6.6,50.8 270 top
C18  9.14,50.8 270 top
C19  11.43,50.8 270 top
C20  59.69,72.01 0 top
C21  58.55,67.44 270 top
C22  55.5,9.65 270 top
C23  53.47,9.65 270 top
C24  54.48,5.84 180 top
C25  65.66,41.66 0 top
C26  73.28,46.23 180 top
C27  36.83,45.97 270 bottom
C28  38.86,45.97 270 bottom
C29  40.01,36.45 90 bottom
C30  33.02,39.88 270 bottom
C31  33.66,43.81 0 bottom
C32  33.4,30.99 90 bottom
C33  40.64,40.26 270 bottom
C34  70.1,41.4 90 top
D1  33.02,35.31 90 bottom
D2  34.42,34.92 270 bottom
IC1  43.94,9.02 180 top
J1  74.3,3.68 90 top
J2  3.05,7.62 0 top
J3  2.54,15.24 0 top
J4  10.16,24.13 180 top
L1  60.83,39.88 90 top
L2  30.99,34.67 270 bottom
LED1  10.41,59.82 90 top
LED2  10.41,55.88 90 top
LIM_VB1  39.43,89.47 0 top
LIM_VB2  40.47,78.99 0 top
M1  27.94,12.7 0 top
MEMS_VB  28.24,78.99 0 top
Q1  35.56,45.72 270 top
R1  36.83,61.98 0 top
R2  32.64,61.98 0 top
R3  22.86,56.9 90 top
R4  22.86,52.07 90 top
R5  47.37,56.77 90 top
R6  47.37,52.2 90 top
R7  22.86,34.67 270 top
R8  22.86,39.37 270 top
R9  6.35,59.69 0 top
R10  47.88,35.05 270 top
R11  47.88,39.37 270 top
R12  6.35,55.88 0 top
R13  51.05,6.73 90 top
R14  30.99,41.15 270 bottom
R15  38.1,35.56 270 bottom
R16  35.94,35.56 270 bottom
R17  40.01,32.51 270 bottom
R18  35.43,30.99 270 bottom
R19  25.02,63.37 45 top
R20  47.12,28.57 45 top
R21  46.35,63.37 135 top
R22  24.64,28.83 135 top
R23  35.69,26.8 180 top
R24  35.56,66.04 0 top
R25  19.81,45.97 90 top
R26  50.8,46.23 270 bottom
R27  6.35,29.21 270 top
R28  8.89,29.21 270 top
U1  36.07,27.18 90 bottom
U2  6.73,43.18 90 top
U4  63.5,67.82 180 top
U5  66.17,46.99 270 top
U6  36.96,40.64 0 bottom
U7  37.21,32 0 bottom
USB1  5.21,69.09 270 top

### Tracks (layer width: path | path; a pad name or v marks a point on that pad's centre or on a via)
2.5V_REF  (via drill 0.35, 0.4)
  Top 0.203: U4.5 U4.6
  Top 0.254: C5.2 36.83,58.82 36.83,58.42
  Top 0.305: R1.2 37.68,59.6 38.86,58.42 | C21.2 58.63,66.87 U4.6 64.44,64.68 64.44,63.97 64.86,63.55 65.57,63.55 66.04,63.08 66.04,55.61 C13.2 67.31,51.43 65.92,50.03 U5.5
  Top 0.406: v48.9,54.86 48.9,56.09 R5.2 45.19,57.62 44.39,58.42 38.86,58.42 36.83,58.42 26.8,58.42 26.12,57.75 R3.2 23.41,57.75 v24.38,56.77 | U4.6 62.26,58.06 62.23,58.04 62.23,56.39 55.12,49.28 55.12,48.51 54.48,47.88 51.69,47.88 50.55,49.02 50.55,51.94 v49.28,53.21 | R10.2 46.1,32.42 46.1,31.31 43.75,28.96 43.11,28.96 42.35,28.19 28.01,28.19 27.31,28.9 27.31,29.9 24.44,32.76 23.92,32.76 R7.2 21.34,35.34 v21.34,35.81
  Bottom 0.254: v49.28,53.21 49.28,52.2 47.12,50.04 47.12,32.89 44.7,30.48 41.39,30.48 R17.2
  Bottom 0.406: v48.9,54.86 49.28,54.48 v49.28,53.21 | v21.34,35.81 21.34,53.72 v24.38,56.77
3.3V  (via drill 0.45, 1 pad 1.91)
  Top 0.254: v59.69,3.81 58.55,3.81 54.74,7.62 52.58,7.62 52.07,8.13 v52.07,8.89
  Top 0.305: IC1.6 51.95,8.77 v52.07,8.89 52.07,8.6 R13.2 | U5.28 70.67,46.74 70.71,46.78 72.07,46.78 C26.2
  Top 0.406: C23.2 55.3,9 C22.2
  Top 0.508: v52.07,8.89 53.35,8.89 C23.2 | C3.2 60.83,37.96 60.83,38.48 | 60.83,38.48 L1.1 | v36.83,15.24 38.1,15.24 40.64,17.78 50.93,17.78 58.04,24.89 58.04,37.85 58.67,38.48 60.83,38.48 | C26.2 72.63,43.2 72.82,43.01 72.82,37.26 65.91,30.35 65.91,15.24 59.48,8.8 C22.2
  Top 1.016: J4.2 19.05,12.7 M1.D
  Bottom 0.508: v52.07,8.89 51.44,8.89 50.67,9.65 50.08,9.65 46.4,13.34 36.2,13.34 35.56,12.7 | 34.29,12.7 v36.83,15.24
  Bottom 0.813: J4.2 19.05,12.7 26.24,12.7 26.9,13.36 32.53,13.36 33.19,12.7 34.29,12.7 35.56,12.7
3.3V_SBW
  Top 0.508: J3.4 5.08,20.32 J4.3
3.3V_USB
  Top 0.203: U2.3 5.96,40.84 5.96,41.91 6.11,42.06 7.18,42.06 7.68,42.57 7.68,43.99 8.14,44.45 8.14,45.52 U2.10 | LED1.A LED2.A 11.16,52.34 10.73,51.91 10.73,50.85 C19.2
  Top 0.254: J4.1 8.89,25.4 R28.2 R27.2 | U2.11 U2.10
  Top 0.508: U2.10 8.32,49.33 C18.2 C19.2 11.43,46.83 12.21,46.05 12.21,45.4 11.43,44.61 11.43,25.4 J4.1
5V_USB  (via drill 0.4)
  Top 0.203: C17.2 6.6,49.53
  Top 0.406: USB1.P$1 6.6,70.78 7.03,70.78 7.11,70.87 v8.51,70.87 | v7.87,52.96 7.41,52.49 7.41,50.95 C17.2 6.6,49.53 6.6,47.35 6.97,46.98 6.97,45.77 U2.12
  Bottom 0.406: v8.51,70.87 8.51,53.59 v7.87,52.96
A_3.3V  (via drill 0.35, 0.45, 0.5, 0.9 pad 1.3, 1 pad 1.91)
  Top 0.203: v36.58,29.08 33.02,32.64 31.75,32.64 v29.84,32.64
  Top 0.254: v74.42,61.85 69.22,56.64 69.22,53.98 68.58,53.34
  Top 0.305: U5.3 66.96,49.53 66.96,50.15 68.58,51.77 68.58,53.34 | 68.58,53.34 v68.58,54.61 | 68.58,53.34 68.95,53.34 C16.2 | v32.26,29.08 32.26,32.13 31.75,32.64
  Top 0.406: v48.26,59.56 48.52,59.31 48.52,58.67 51.1,56.09 51.1,49.25 51.83,48.53 54.34,48.53 54.56,48.74 54.56,49.51 57.97,52.91 57.97,54.16 v58.42,54.61 58.42,55.4 58.55,55.53 58.55,64.64 57.15,66.04 57.15,69.34 58.42,70.61 60.41,70.61 | C14.2 C15.2 69.58,53.34 C16.2 | 60.41,70.61 U4.4 U4.3 | C20.2 60.34,70.68 60.41,70.61 | v45.72,55.88 45.47,55.63 42.1,55.63 40.07,53.59 v38.23,53.59
  Top 0.508: L1.2 59.83,41.53 C6.2 59.29,42.71 59.29,42.78 58.26,43.81 v57.66,43.81
  Bottom 0.203: v29.84,32.64 29.59,32.64 29.21,33.02 29.21,33.61 29.52,33.91 29.52,41.48 32.55,44.52 36.02,44.52 C27.2
  Bottom 0.254: C28.2 38.86,41.98 U6.1 39.75,42.87 39.75,43.99 39.7,44.04 39.7,45.55 v40.51,46.35 | U7.P$8 36.58,29.47 v36.58,29.08
  Bottom 0.305: U1.P$8 v32.26,29.08
  Bottom 0.406: v58.42,54.61 64.59,54.61 65.22,55.24 65.85,55.24 66.48,54.61 v68.58,54.61 | C27.2 C28.2 38.27,45.92 38.06,46.13 38.06,47.12 38.23,47.29 v38.23,53.59 | v48.26,59.56 v45.72,55.88
  Bottom 0.508: v57.66,43.81 57.66,53.85 v58.42,54.61
AIN_N  (via drill 0.35)
  Top 0.203: C10.2 61.45,48.27 v61.59,48.13 62.67,48.13 62.97,47.83 U5.11 | C11.2 60.5,44.88 v61.85,46.23 62.55,46.23 62.97,46.65 U5.13 | C9.2 61.55,51.36 v62.48,50.42 62.48,49.79 U5.9 | v66.17,51.82 66.17,52.21 C8.2 65.42,50.59 64.88,50.05 U5.7
  Top 0.305: C8.2 64.48,53.9 60.76,53.9 56.01,49.15 56.01,47.75 55.5,47.24 51.05,47.24 49.96,48.34 49.96,51.07 48.39,52.64 48.39,53.85 48.7,54.16 49.19,54.16 49.6,54.57 49.6,56.87 44.68,61.79 44.68,62.76 44.11,63.32 43.15,63.32 43.01,63.47 37.69,63.47 36.2,61.98 R1.1 R2.2
  Bottom 0.203: v66.17,51.82 63.37,51.31 v62.48,50.42 62.48,49.02 v61.59,48.13 61.59,46.48 v61.85,46.23
AINP_0
  Top 0.203: C9.1 60.75,50.59 62.83,48.52 62.83,48.48 62.98,48.33 U5.10
  Top 0.254: 60.75,50.59 59.48,50.59 57.91,49.02 57.91,47.62 56.52,46.23 50.23,46.23 49,47.46 49,48.28 48.01,49.28 46.74,49.28 45.67,48.21 27.02,48.21 26.21,49.01 26.21,49.57 R4.2
  Top 0.305: R3.1 R4.2
AINP_1
  Top 0.203: C8.1 U5.8
  Top 0.254: R6.2 49.53,50.89 49.53,47.75 50.55,46.74 56.01,46.74 56.52,47.24 56.52,48.9 60.96,53.34 63.74,53.34 C8.1
  Top 0.305: R5.1 47.37,54.61 R6.2
AINP_2
  Top 0.203: C10.1 61.83,46.98 62.23,47.37 63.06,47.37 63.1,47.33 63.57,47.33 U5.12
  Top 0.254: 58.44,45.72 C10.1
  Top 0.305: R7.1 R8.2 24.22,37.16 24.68,37.16 25.09,36.74 25.09,36.29 25.69,35.69 41.91,35.69 44.58,35.69 46.35,37.47 46.35,44.45 47.62,45.72 58.44,45.72
AINP_3
  Top 0.203: C11.1 61.42,44.59 62.98,46.15 U5.14
  Top 0.254: C11.1 59.39,43.48 57.78,45.09 47.88,45.09 46.99,44.2 46.99,39.41 R11.2
  Top 0.305: R11.2 R10.1
AMP_I
  Bottom 0.203: C33.1 40.58,40.97 U6.2
AMP_VB
  Bottom 0.254: Q1.6 29.97,49.02 29.97,52.96 31.24,54.23 31.24,57.78 33.53,60.07 33.53,73.03 33.03,73.52 29.34,73.52 27.79,75.08 27.79,76.74 17.97,86.56 AMP_VB.1
AMP_VDD
  Bottom 0.254: Q1.2 32.38,61.59 32.38,71.88 31.88,72.39 25.64,72.39 19.04,78.99 AMP_VDD.1
AMP_VREF
  Bottom 0.254: Q1.4 30.35,54.48 30.35,58.04 33.02,60.71 33.02,72.39 32.51,72.9 26.42,72.9 23.88,75.44 23.88,78.99 17.75,85.12 14.18,85.12 12.47,86.83 12.47,88.24 11.24,89.47 AMP_VREF.1
AMP_VSS
  Bottom 0.254: Q1.9 25.65,41.66 25.65,42.29 26.54,43.18 29.59,43.18 30.1,43.69 30.1,45.47 31.37,46.74 31.37,52.45 32.51,53.59 32.51,57.28 34.67,59.44 34.67,73.41 33.61,74.46 30.44,74.46 29,75.9 29,77.13 29.81,77.93 29.81,79.76 28.7,80.86 AMP_VSS.1
BUF_VB
  Bottom 0.254: Q1.21 37.85,57.4 37.85,71.5 39.53,73.19 43.41,73.19 46.04,75.82 46.04,80.09 49.85,83.9 52.79,83.9 57.62,88.72 59.49,88.72 60.04,88.18 61.47,88.18 62.77,89.47 BUF_VB.1
BUF_VDD
  Bottom 0.254: Q1.22 41.53,56.26 39.88,56.26 38.61,57.53 38.61,71.37 39.88,72.64 43.73,72.64 50.08,78.99 BUF_VDD.1
BUF_VO  (via drill 0.35)
  Top 0.254: v38.35,28.96 38.35,30.48 | 38.35,30.48 38.35,31.95 v41.41,35 | v40.39,29.46 39.37,29.46 38.35,30.48
  Bottom 0.203: U7.P$7 U7.P$6
  Bottom 0.254: U7.P$6 38.11,29.2 v38.35,28.96 | v41.41,35 41.41,45.22 Q1.19 40.39,49.78 40.39,52.96 36.7,56.64 36.7,72.01 41.08,76.39 41.08,76.94 44.8,80.66 44.8,86.39 47.88,89.47 BUFF_VO.1 | U1.P$2 U1.P$1 38.38,27.18 40.01,28.8 40.01,29.08 v40.39,29.46
BUF_VSS
  Bottom 0.254: Q1.14 45.21,36.32 45.21,49.91 43.99,51.13 42.13,51.13 41.58,51.68 41.58,52.78 37.34,57.02 37.34,71.75 39.5,73.91 42.77,73.91 45.42,76.56 45.42,82.12 48.51,85.22 53.47,85.22 57.72,89.47 BUF_VSS.1
CSB_B  (via drill 0.35)
  Top 0.203: IC1.15 45.69,15.21 46.61,16.13 56.26,16.13 57.91,17.78 59.44,17.78 v61.21,16 | v72.39,50.67 71.5,49.78 71.5,48.77 70.99,48.26 68.69,48.26 U5.31
  Bottom 0.203: v72.39,50.67 70,48.28 70,42.56 67.84,40.4 67.84,33.54 62.41,28.11 62.41,24.05 60.2,21.84 60.2,17.02 v61.21,16 61.21,14.73 62.36,13.59 74.04,13.59 J1.5
D+  (via drill 0.35)
  Top 0.203: USB1.P$3 6.4,68.89 6.99,68.89 7.3,68.58 8.89,68.58 10.14,67.33 C4.2 10.14,63.99 v10.03,63.88 | v10.54,40.39 9.23,40.39 U2.8
  Bottom 0.203: v10.03,63.88 10.03,40.89 v10.54,40.39
D-  (via drill 0.35)
  Top 0.203: USB1.P$2 6.32,69.85 C2.2 10.14,68.59 v10.67,68.07 | v11.43,45.72 11.4,45.7 U2.9
  Bottom 0.203: v10.67,68.07 10.67,46.48 v11.43,45.72
DIN_B  (via drill 0.35)
  Top 0.203: IC1.13 47.87,14.37 59.07,14.37 v59.31,14.61 | v70.87,50.16 70.87,49.15 70.48,48.77 68.7,48.77 U5.32
  Bottom 0.203: v70.87,50.16 69.65,48.95 69.65,42.71 67.49,40.55 67.49,33.69 62.05,28.25 62.05,24.33 59.69,21.97 59.69,14.99 v59.31,14.61 60.84,14.61 62.21,13.23 73.22,13.23 74.3,12.15 J1.4
DOUT_B  (via drill 0.35)
  Top 0.2: IC1.12 48.22,11.77 49.91,13.46
  Top 0.203: v62.61,14.86 60.46,14.86 59.57,13.97 50.42,13.97 49.91,13.46 | v72.14,49.4 72.14,48.51 71.36,47.74 U5.30
  Bottom 0.203: v72.14,49.4 70.36,47.62 70.36,42.41 68.22,40.28 68.22,40.16 68.2,40.13 68.2,33.4 62.76,27.96 62.76,23.77 60.96,21.97 60.96,17.78 62.61,16.13 v62.61,14.86 63.5,13.97 71.88,13.97 J1.6
GND  (via drill 0.4, 0.45)
  Top 0.203: U5.6 65.32,49.4 65.32,48.93 65.15,48.76 U5.P$7 | U5.4 66.32,49.4 66.32,48.93 66.17,48.77 U5.P$6 | U5.29 U5.P$2 | U5.21 66.32,44.58 66.32,45.05 66.17,45.21 U5.P$5
  Bottom 0.254: U6.5 35.97,39.65 U6.9
  other vias: 13.34,44.07 3.81,30.48 13.21,22.1 19.18,16 3.81,18.03 13.21,14.1 14.73,10.16 2.79,27.18 16.89,3.05 27.18,3.05 30.61,6.22 15.24,6.35 9.4,8.64 38.35,1.78 50.55,2.54 57.53,6.22 60.07,6.35 62.99,6.35 60.83,8.13 55.63,18.8 26.16,16.64 75.56,42.04 53.98,13.21 67.18,27.69 64.14,25.65 63.88,32.51 63.37,42.55 69.6,38.35 72.01,42.67 73.79,50.29 75.18,56.77 71.63,60.83 65.15,64.26 68.07,59.05 60.07,64.64 60.07,68.83 54.61,69.22 67.56,72.77 71.5,69.47 72.26,76.33 62.48,79.25 43.81,28.19 28.07,29.21 23.11,42.55 42.55,26.92 47.12,31.62 24.13,32 28.83,26.67 21.46,32.38 40.77,27.05 49.28,32 7.62,77.98 13.72,67.18 13.34,55.24 13.08,48.51 3.17,60.58 2.41,50.42 2.41,34.8 12.95,40.26 65.53,54.48 63.5,38.73 6.99,54.36 64.26,57.28 64.26,60.83 60.2,61.85 61.09,59.18 20.95,60.45 29.21,66.42 42.16,64.39 46.1,46.74 48.77,43.18 53.21,50.04 55.88,43.81 56.52,62.1 56.52,58.17 56.39,54.48 57.15,40.64 50.16,60.58 47.5,66.42 66.29,6.35 37.72,8.13 19.56,55.5 19.56,51.05 23.11,45.59 36.2,54.74 33.78,47.12 33.66,49.02 39.37,50.04 38.1,43.56 40.39,44.32 38.23,37.85 34.54,37.97 34.16,33.27 37.08,34.8 31.37,29.84 25.53,33.66 45.72,34.42 40.26,61.85 33.4,42.29 35.31,55.37 40.51,57.15 40.39,59.44 24.64,55.63 25.02,59.05 24.64,53.47 23.24,49.15 35.31,47.12 35.31,49.66 30.99,65.53 53.34,18.16 62.1,30.73 65.66,34.04 36.7,17.14 51.94,43.31 64.52,11.68 66.55,11.68 68.71,11.68 63.12,8.13 66.04,8.13 66.93,14.73 64.14,16.89 70.87,14.86 67.18,18.03 69.47,17.91 71.63,17.91 66.93,19.81 69.34,20.45 71.88,20.45 73.15,30.61 69.34,36.45 64.64,27.94 69.47,32.13 67.56,30.48 60.45,29.08 60.33,26.67 59.94,24.64 57.91,21.21 62.99,22.1 67.18,24.13 72.14,34.8 73.79,39.62 73.79,43.94 61.34,35.05 48.13,47.12 50.67,10.67
  pour Top: 24.13,68.07 49.02,68.07 52.45,64.64 52.45,27.56 48.64,23.75 24.64,23.75 17.65,30.73 17.65,61.59
  pour Top: -1.27,59.94 -1.27,0 0,-1.27 77.47,-1.27 80.01,1.27 80.01,60.33 57.53,60.33 54.74,57.53 54.74,26.54 49.78,21.59 22.73,21.59 14.86,29.46 14.86,59.94
  pour Top: 14.99,58.42 14.99,63.37 22.61,70.99 49.66,70.99 54.99,65.66 54.99,56.9 76.71,56.9 78.11,58.29 78.11,96.65 -1.65,96.65 -1.65,59.56 -0.51,58.42
  pour Bottom: 49.78,21.59 22.73,21.59 14.99,29.34 14.99,59.82 -1.4,59.82 -1.4,0.13 0,-1.27 77.47,-1.27 80.01,1.27 80.01,60.33 57.66,60.33 54.99,57.66 54.99,46.1 54.74,45.85 54.74,26.54
  pour Bottom: -1.65,96.65 78.11,96.65 78.11,58.29 76.71,56.9 55.12,56.9 54.99,57.02 54.99,65.53 49.53,70.99 22.73,70.99 14.99,63.25 14.99,58.42 -0.51,58.42 -1.65,59.56
  pour Bottom: 24,68.07 49.02,68.07 52.45,64.64 52.45,53.09 53.21,52.32 55.24,52.32 55.24,38.73 52.45,38.73 52.45,27.56 48.51,23.62 24.77,23.62 17.65,30.73 17.65,61.72
  pour Top: 52.07,44.45 55.88,44.45 55.88,41.91 52.07,41.91
LIM_VB1  (via drill 0.35)
  Top 0.254: v30.23,39.12 30.23,43.31 v30.99,44.07
  Bottom 0.254: D1.A 32.77,35.63 30.23,38.17 v30.23,39.12 | v30.99,44.07 30.99,45.59 32,46.61 32,52.07 33.15,53.21 33.15,57.02 35.43,59.31 35.43,72.64 35.43,82.92 39.43,86.92 LIM_VB1.1
LIM_VB2  (via drill 0.35)
  Top 0.254: v31.24,38.23 32.38,39.37 v32.38,45.21
  Bottom 0.254: D2.C 31.34,38.33 v31.24,38.23 | v32.38,45.21 32.38,46.1 32.64,46.35 32.64,51.69 33.78,52.83 33.78,56.77 36.07,59.05 36.07,72.14 40.47,76.54 LIM_VB2.1
MEMS_IN
  Bottom 0.203: C32.2 33.02,32.02 D1.C | D1.C 31.71,33.67 L2.2 30.99,32.13 30.61,31.75 Q1.12 | D2.A 33.4,34.6 D1.C
MEMS_OUT  (via drill 0.35)
  Top 0.254: Q1.13 43.18,30.73 v41.53,29.08
  Bottom 0.203: Q1.13 40.77,34.16 40.77,39.48 C33.2
  Bottom 0.254: v41.53,29.08 38.72,26.28 U1.P$3
MEMS_VB  (via drill 0.35)
  Top 0.254: v26.16,37.97 29.46,37.97 v30.23,37.21
  Bottom 0.254: Q1.11 25.15,37.08 | 25.15,37.08 25.15,44.45 26.54,45.85 29.46,45.85 30.61,46.99 30.61,52.7 31.88,53.98 31.88,57.53 34.16,59.82 34.16,73.28 33.51,73.93 29.77,73.93 28.24,75.46 MEMS_VB.1 | 25.15,37.08 26.04,37.97 v26.16,37.97 | v30.23,37.21 30.99,36.45 L2.1
MSP_RX  (via drill 0.35, 1 pad 1.91)
  Top 0.203: U2.1 4.51,39.18 v3.94,38.61 | IC1.24 v41.19,14.52
  Top 0.254: v3.94,38.61 3.94,32.27 R27.1
  Bottom 0.203: v3.94,38.61 3.94,35.69 18.54,21.08 | v41.19,14.52 36.79,18.92 20.7,18.92 18.54,21.08 | v16.38,18.8 18.54,20.95 18.54,21.08
MSP_TX  (via drill 0.35, 1 pad 1.91)
  Top 0.203: IC1.23 41.79,13.29 41.79,14.1 v42.29,14.6 v42.29,14.61 | U2.4 6.41,36.51 v7.11,35.81
  Top 0.254: v7.11,35.81 8.89,34.04 R28.1
  Bottom 0.203: v42.29,14.61 42.29,14.86 37.72,19.43 21.08,19.43 7.11,33.4 v7.11,35.81 9.27,35.81 v9.53,36.07
N$1
  Top 0.203: C25.2 U5.20
N$2
  Top 0.203: U5.19 C25.1
N$3
  Bottom 0.203: R16.1 34.88,36.21 31.92,39.17 31.92,40.86 R14.1 C31.2
N$4
  Bottom 0.203: U6.3 38.74,40.31 40.01,39.04 C29.2
N$6
  Top 0.203: U4.1 65.86,66.87 C12.2
N$7
  Bottom 0.203: C30.2 35.08,39.23 R15.1 37.5,35.61 34.98,35.61 30.99,39.6 R14.2
N$10
  Top 0.305: U5.26 68.71,45.7 69.25,45.7 70.1,44.85 C34.2
N$12
  Bottom 0.203: R17.1 39.85,33.16 R15.2 U7.P$3
N$13
  Bottom 0.203: R16.2 35.43,34.4 R18.1 36.45,32.66 37.44,32.66 37.66,32.44 U7.P$2
N$15  (via drill 0.35)
  Top 0.254: U2.6 7.68,38.42 v7.75,38.35 | v5.46,38.35 5.14,38.67 U2.2
  Bottom 0.254: v7.75,38.35 v5.46,38.35
N$18
  Bottom 0.203: R18.2 35.43,28.96 36.07,28.32 38.99,28.32 39.62,28.96 39.62,29.72 39.24,30.1 U7.P$5 | U7.P$1 35.49,30.34 R18.2 | C32.1 R18.2
N$19
  Bottom 0.203: C30.1 33.24,40.31 U6.6
N$20
  Top 0.203: R12.2 LED2.C
N$21
  Top 0.203: R9.2 7.33,59.82 LED1.C
N$26
  Bottom 0.203: C31.1 34.3,41.84 35.17,40.97 U6.7
P3.6  (via drill 1 pad 1.91)
  Top 0.203: IC1.36 37.89,6.27 v36.83,5.21
RDYB_B  (via drill 0.35)
  Top 0.2: IC1.16 45.19,14.37 v44.07,15.49
  Top 0.203: v70.74,51.31 68.92,49.49 U5.1
  Bottom 0.203: v44.07,15.49 45.72,13.84 46.61,13.84 48.01,12.45 55.37,12.45 55.75,12.83 | v70.74,51.31 69.29,49.86 69.29,42.85 67.13,40.7 67.13,33.84 61.7,28.4 61.7,24.49 59.18,21.97 59.18,16.26 55.75,12.83 | 55.75,12.83 71.12,12.83 71.12,12.79 74.3,9.62 J1.3
RSTB_B  (via drill 0.35)
  Top 0.2: IC1.17 44.59,13.29 44.59,14.1 44.45,14.24 44.05,14.24 v42.67,15.62
  Top 0.203: v42.67,15.62 43.56,16.51 55.88,16.51 59.18,19.81 61.59,19.81 v62.1,19.3 | U5.27 70.85,46.24 v70.99,46.1
  Bottom 0.203: v70.99,46.1 71.12,45.97 71.12,42.67 68.58,40.13 68.58,33.27 63.12,27.81 63.12,23.5 61.47,21.84 61.47,19.94 v62.1,19.3 62.48,18.92 J1.7
RX#1
  Top 0.203: R12.1 5.5,47.04 5.6,46.94 5.6,45.87 U2.14
SBW_RST
  Top 0.203: IC1.5 48.21,8.17 49.17,8.17 49.63,7.71 49.63,6.76 50.5,5.88 R13.1 53.79,5.88 C24.2
  Top 0.305: J3.2 5.08,11.43 11.43,5.08 33.48,5.08 35.08,3.48 50.35,3.48 51.05,4.19 R13.1
SBW_TEST  (via drill 0.4)
  Top 0.305: J3.3 7.62,12.21 12.55,7.28 34.33,7.28 37.4,10.35 v37.34,10.41 | v49.91,4.57 49.22,5.26 49.22,7.54 49.04,7.72 48.16,7.72 IC1.4
  Bottom 0.305: v37.34,10.41 39.8,10.41 44.55,5.67 48.82,5.67 v49.91,4.57
SCLK_B  (via drill 0.35)
  Top 0.2: IC1.14 46.19,15.08 46.61,15.49
  Top 0.203: 46.61,15.49 57.02,15.49 v58.17,16.64 | v69.22,51.05 68.36,50.2 67.66,50.2 67.51,50.05 67.51,49.59 U5.2 | IC1.14 46.19,8.16 v46.23,8.13
  Bottom 0.203: v58.17,16.64 58.17,16.76 58.83,17.42 58.83,22.12 61.34,24.63 61.34,28.55 66.78,33.98 66.78,40.84 68.94,43 68.94,50.77 v69.22,51.05 | v46.23,8.13 47.12,7.24 73.28,7.24 J1.2
TCTRL_0  (via drill 0.35, 0.4, 1 pad 1.91)
  Top 0.203: IC1.46 45.69,6.32 v45.72,6.35 | v24.13,8.89 25.91,10.67 v25.91,11.18
  Top 0.305: M1.G v25.91,11.18
  Bottom 0.203: v45.72,6.35 45.09,6.99 45.09,10.16 43.43,11.81 36.45,11.81 35.05,10.41 34.04,10.41 31.88,12.57 27.3,12.57 v25.91,11.18
TX#1  (via drill 0.35)
  Top 0.203: R9.1 5.5,57.29 4.05,55.84 4.05,52.89 v4.87,52.07 | U2.7 8.5,40.84 8.5,41.91 8.89,42.31 v8.89,43.18
  Bottom 0.203: v4.87,52.07 4.87,47.2 v8.89,43.18
VFB_0  (via drill 0.35, 0.45)
  Top 0.203: IC1.45 45.1,4.94 45.1,5.75 44.45,6.39 v44.45,6.73
  Top 0.406: M1.S 29.28,10.41 v29.97,10.41
  Top 0.508: v50.8,42.67 52.07,41.4 52.07,41.15
  Top 1.016: M1.S 36.54,19.05 50.04,19.05 56.52,25.53 56.52,38.73 54.1,41.15 52.32,41.15 52.07,41.4 | 52.07,41.15 49.53,38.61 49.53,33.25 50.34,32.45 50.34,31.56 49.72,30.94 49.48,30.94 R20.2 47.98,29.43 47.98,27.22 46.46,25.71 45.91,25.71 45.79,25.83 43.76,25.83 43.58,25.65 38.25,25.65 R23.1 37.11,26.06 36.2,25.15 26.04,25.15 23.63,27.55 R22.2 23.01,29.21 21.59,29.21 19.81,30.99 R25.1 21.47,46.21 21.47,58.34 24.01,60.88 R19.1 24.16,62.52 24.16,64.72 25.68,66.24 27.59,66.24 29.73,64.1 35.04,64.1 R24.2 40.02,66.04 40.45,65.61 44.52,65.61 45.15,66.24 45.7,66.24 47.21,64.72 47.21,62.52 R21.1
  Bottom 0.203: v44.45,6.73 44.45,10.03 43.18,11.3 36.58,11.3 35.31,10.03 30.35,10.03 v29.97,10.41
  Bottom 0.508: v50.8,42.67 R26.2

### Text on the board
tNames: TX | NC | 3.3V | RSTB | RX | 3.3V_SBW | 3.3V_USB | DOUT | CSB | Rst | DIN | Gnd | Test | SBW_3.3V | TCTRL | RDYB | SCLK | P3.6 | Gnd | Gnd | GND
bNames: U7